# Altium schematic sheet Connectors.SchDoc
size A4; DocumentNumber: 4; SheetNumber: 4; SheetTotal: 4
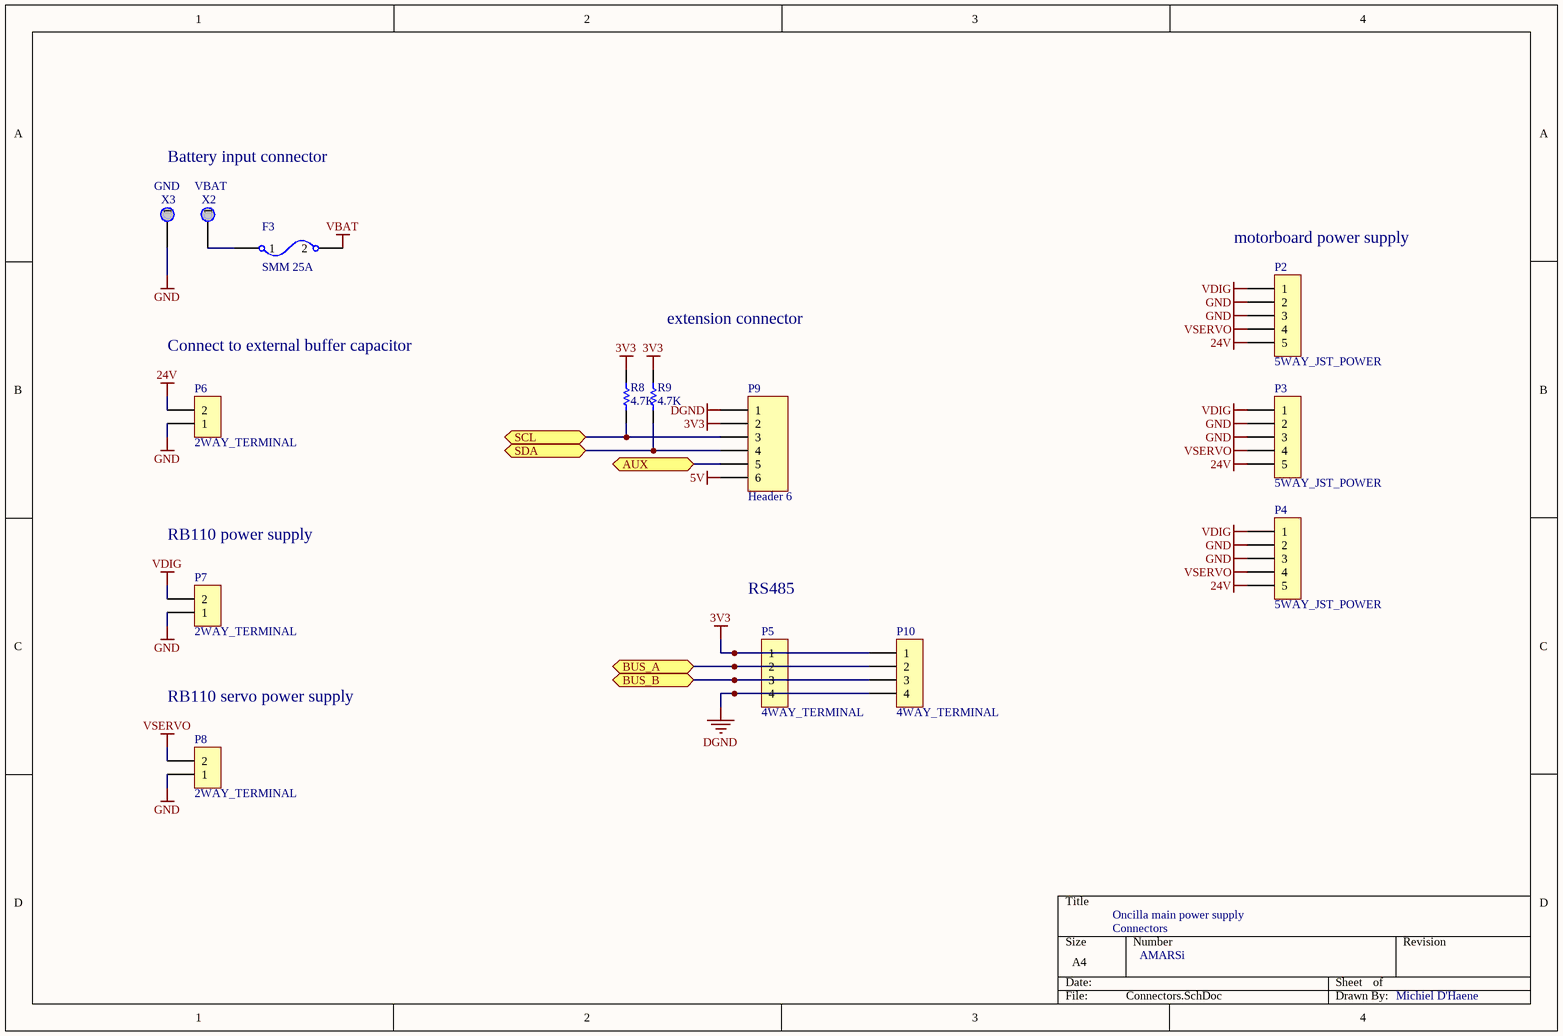
[diagram p0: Connectors.SchDoc]

## Parts
F3  SMM 25A  [FUSE SMM]
P2  5WAY_JST_POWER  [TERMINAL_5WAY_35]
P3  5WAY_JST_POWER  [TERMINAL_5WAY_35]
P4  5WAY_JST_POWER  [TERMINAL_5WAY_35]
P5  4WAY_TERMINAL  [MICROMATCH_4WAY_SE]
P6  2WAY_TERMINAL  [TYCO_2WAY_35MM]
P7  2WAY_TERMINAL  [TYCO_2WAY_35MM]
P8  2WAY_TERMINAL  [TYCO_2WAY_35MM]
P9  Header 6  [HDR1X6]
P10  4WAY_TERMINAL  [MICROMATCH_4WAY_SE]
R8  4.7k  [RESC1608L]
R9  4.7k  [RESC1608L]
X2  VBAT  [TESTPIN 2MM]
X3  GND  [TESTPIN 2MM]

## Ports
AUX, BUS_A, BUS_B, SCL, SDA

## Nets
3V3: P5.1 P9.2 P10.1 R8.2 R9.2
5V: P9.6
24V: P2.5 P3.5 P4.5 P6.2
DGND: P5.4 P9.1 P10.4
GND: P2.2 P2.3 P3.2 P3.3 P4.2 P4.3 P6.1 P7.1 P8.1 X3.1
VBAT: F3.2
VDIG: P2.1 P3.1 P4.1 P7.2
VSERVO: P2.4 P3.4 P4.4 P8.2
AUX: P9.5 ; port AUX
BUS_A: P5.2 P10.2 ; port BUS_A
BUS_B: P5.3 P10.3 ; port BUS_B
SCL: P9.3 R8.1 ; port SCL
SDA: P9.4 R9.1 ; port SDA
NetF3_1: F3.1 X2.1

## Notes on the sheet
- Battery input connector
- (near P2) motorboard power supply
- Connect to external buffer capacitor
- extension connector
- RB110 power supply
- RS485
- RB110 servo power supply
- Oncilla main power supply
- Connectors
- AMARSi
- Michiel D'Haene

## Library data of the parts
F3 = fuse
P9 = Header 6: Header, 6-Pin; LatestRevisionDate: 17-Jul-2002; LatestRevisionNote: Re-released for DXP Platform.; Publisher: Altium Limited
R8 R9 = Res Semi: Semiconductor Resistor; Published: 8-Jun-2000; LatestRevisionDate: 17-Jul-2002; LatestRevisionNote: Re-released for DXP Platform.; PackageReference: AXIAL-0.5; Publisher: Altium Limited; Value: 4.7K
X2 X3 = 1WAY_TERMINAL